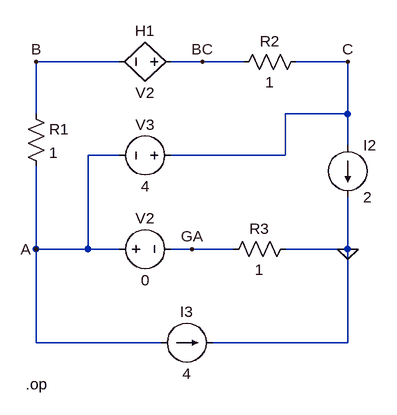
[diagram p0: schematic SITtoSUCI.asc]
SITtoSUCI.asc, the LTspice schematic file:
Version 4
SHEET 1 880 680
WIRE 144 80 16 80
WIRE 272 80 224 80
WIRE 336 80 272 80
WIRE 496 80 416 80
WIRE 16 160 16 80
WIRE 496 160 496 80
WIRE 496 160 400 160
WIRE 496 208 496 160
WIRE 144 224 96 224
WIRE 400 224 400 160
WIRE 400 224 224 224
WIRE 16 368 16 240
WIRE 96 368 96 224
WIRE 96 368 16 368
WIRE 144 368 96 368
WIRE 256 368 224 368
WIRE 320 368 256 368
WIRE 496 368 496 288
WIRE 496 368 400 368
WIRE 16 512 16 368
WIRE 208 512 16 512
WIRE 496 512 496 368
WIRE 496 512 288 512
FLAG 16 368 A
FLAG 16 80 B
FLAG 496 80 C
FLAG 256 368 GA
FLAG 272 80 BC
FLAG 496 368 0
SYMBOL res 0 144 R0
SYMATTR InstName R1
SYMATTR Value 1
SYMBOL res 432 64 R90
WINDOW 0 0 56 VBottom 2
WINDOW 3 32 56 VTop 2
SYMATTR InstName R2
SYMATTR Value 1
SYMBOL voltage 128 368 R270
WINDOW 0 32 56 VTop 2
WINDOW 3 -32 56 VBottom 2
SYMATTR InstName V2
SYMATTR Value 0
SYMBOL res 416 352 R90
WINDOW 0 0 56 VBottom 2
WINDOW 3 32 56 VTop 2
SYMATTR InstName R3
SYMATTR Value 1
SYMBOL current 496 208 R0
SYMATTR InstName I2
SYMATTR Value 2
SYMBOL current 208 512 R270
WINDOW 0 32 40 VTop 2
WINDOW 3 -32 40 VBottom 2
SYMATTR InstName I3
SYMATTR Value 4
SYMBOL voltage 240 224 R90
WINDOW 0 -32 56 VBottom 2
WINDOW 3 32 56 VTop 2
SYMATTR InstName V3
SYMATTR Value 4
SYMBOL h 240 80 R90
WINDOW 0 -32 56 VBottom 2
WINDOW 3 32 56 VTop 2
SYMATTR InstName H1
SYMATTR Value V2
SYMATTR Value2 -0.33333334
TEXT 0 576 Left 2 !.op

The netlist it stands for:
* SITtoSUCI.asc
R1 B A 1
R2 C BC 1
V2 A GA 0
R3 0 GA 1
I2 C 0 2
I3 A 0 4
V3 C A 4
H1 BC B V2 -0.33333334
.op
.backanno
.end